# EAGLE design RPi Lego Server Daughter Board v1_0A (EAGLE 7.2.0)
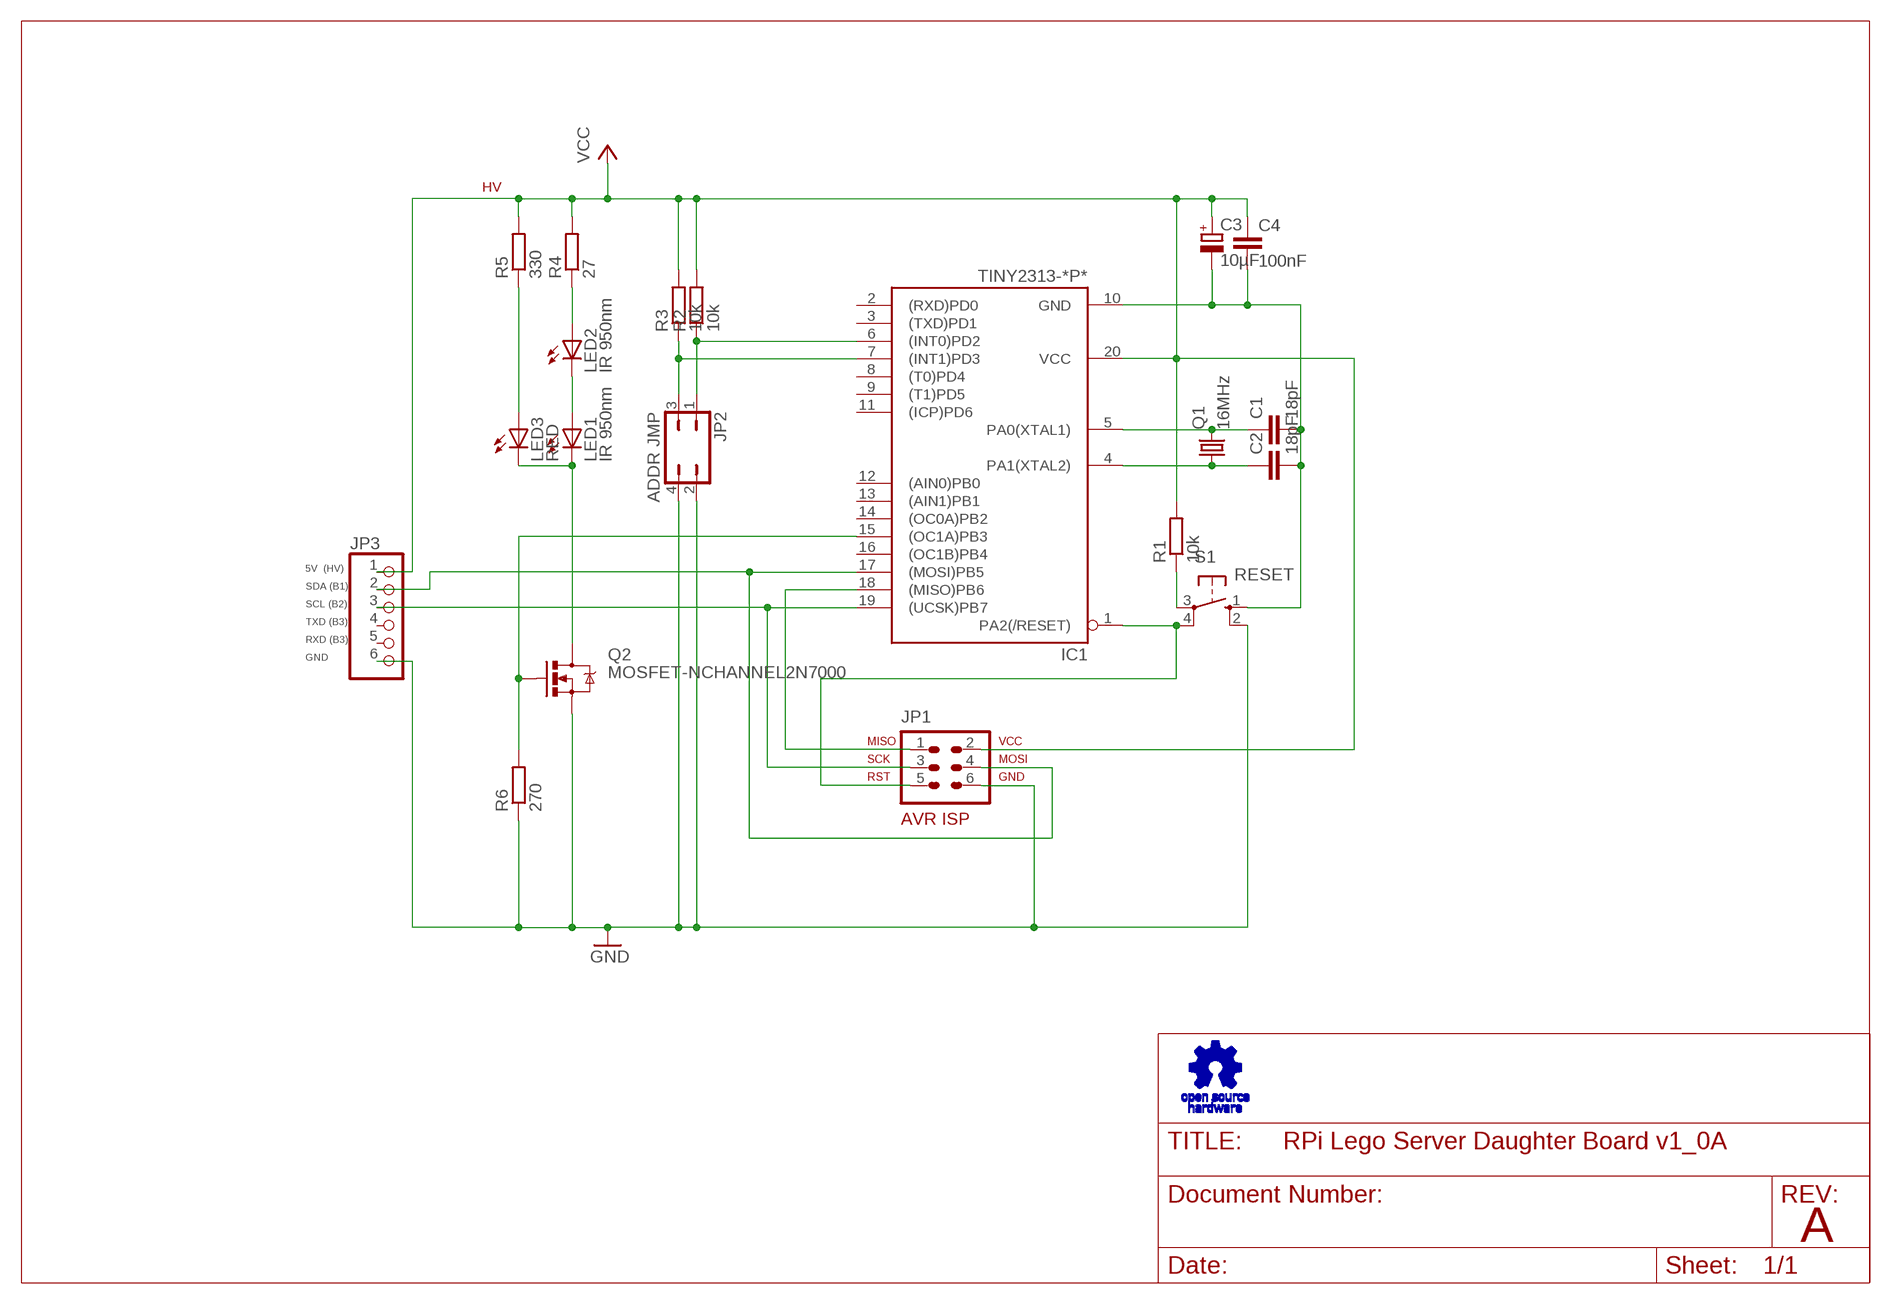
[diagram p0: schematic, sheet 1]

## Parts
C1  18pF  C-EU025-025X050  [C025-025X050]
C2  18pF  C-EU025-025X050  [C025-025X050]
C3  10µF  CPOL-EUE2.5-6  [E2,5-6]
C4  100nF  C-EU050-030X075  [C050-030X075]
IC1  TINY2313-*P*  [DIL20]
JP1  AVR-ISP-6VERT  [AVR-ISP-6]
JP2  ADDR JMP  JP2Q  [JP2Q]
JP3  PINHD-1X6  [1X06]
LED1  IR 950nm  LED5MM  [LED5MM]
LED2  IR 950nm  LED5MM  [LED5MM]
LED3  RED  LED3MM  [LED3MM]
Q1  16MHz  CRYSTALHC49S  [HC49/S]
Q2  MOSFET-NCHANNEL2N7000  [TO-92]
R1  10k  R-EU_0207_10  [0207/10]
R2  10k  R-EU_0207_10  [0207/10]
R3  10k  R-EU_0207_10  [0207/10]
R4  27  R-EU_0207_10  [0207/10]
R5  330  R-EU_0207_10  [0207/10]
R6  270  R-EU_0207_10  [0207/10]
S1  RESET  10-XX  [B3F-10XX]

## Nets
GND: C1.2 C2.2 C3.- C4.2 IC1.10(GND) JP1.6 JP2.2 JP2.4 JP3.6 Q2.1(S) R6.1 S1.1(S) S1.2(S1)
I2CADDRH: IC1.7((INT1)PD3) JP2.3 R3.1
I2CADDRL: IC1.6((INT0)PD2) JP2.1 R2.1
MISO: IC1.18((MISO)PB6) JP1.1
MOSI: IC1.17((MOSI)PB5) JP1.4 JP3.2
N$9: R1.1 S1.3(P)
N$12: LED2.A R4.1
N$13: LED3.A R5.1
N$14: LED1.A LED2.K(C)
N$15: LED1.K(C) LED3.K(C) Q2.3(D)
N$17: IC1.15((OC1A)PB3) Q2.2(G) R6.2
RST: IC1.1(PA2(/RESET)) JP1.5 S1.4(P1)
SCL: IC1.19((UCSK)PB7) JP1.3 JP3.3
VCC: C3.+ C4.1 IC1.20(VCC) JP1.2 JP3.1 R1.2 R2.2 R3.2 R4.2 R5.2
XTAL1: C2.1 IC1.4(PA1(XTAL2)) Q1.1
XTAL2: C1.1 IC1.5(PA0(XTAL1)) Q1.2
Unconnected: IC1.2((RXD)PD0) IC1.3((TXD)PD1) IC1.8((T0)PD4) IC1.9((T1)PD5) IC1.11((ICP)PD6) IC1.12((AIN0)PB0) IC1.13((AIN1)PB1) IC1.14((OC0A)PB2) IC1.16((OC1B)PB4) JP3.4 JP3.5

## Notes on the sheet
- HV
- 5V  (HV)
- SDA (B1)
- SCL (B2)
- TXD (B3)
- RXD (B3)
- GND
- /Users/xjmaas/Downloads/OSHW_Logo.bmp
- A

## Library data of the parts
C1 C2 C4 = rcl:C-EU: CAPACITOR, European symbol
C3 = rcl:CPOL-EU: POLARIZED CAPACITOR, European symbol
IC1 = avr-7:TINY2313*: Atmel Tiny2313 2K Flash, 128 bytes EEPROM, 128 bytes RAM
JP1 = avr-7:AVR-ISP-6: AVR ISP-6 Serial Programming Header
JP2 = jumper:JP2Q: JUMPER
JP3 = pinhead:PINHD-1X6: PIN HEADER
LED1-LED3 = led:LED: LED OSRAM: - CHIPLED LG R971, LG N971, LY N971, LG Q971, LY Q971, LO R971, LY R971 LH N974, LH R974 LS Q976, LO Q976, LY Q976 LO Q996 - Hyper CHIPLED LW Q18S LB Q993, LB Q99A, LB R99A - SideLED LS A670, LO A670, LY A670, LG A670, LP A670 LB A673, LV A673, LT A673, LW A673 LH A674 LY A675 LS A676, LA A676, LO A676, LY A676, LW A676 LS A679, LY A679, LG A679 - Hyper Micro SIDELED® LS Y876, LA Y876, LO Y876, LY Y876 LT Y87S - SmartLED LW L88C, LW L88S LB L89C, LB L89S, LG L890 LS L89K, LO L89K, LY L89K LS L896, LA L896, LO L896, LY L896 - TOPLED LS T670, LO T670, LY T670, LG T670, LP T670 LSG T670, LSP T670, LSY T670, LOP T670, LYG T670 LG T671, LOG T671, LSG T671 LB T673, LV T673, LT T673, LW T673 LH T674 LS T676, LA T676, LO T676, LY T676, LB T676, LH T676, LSB T676, LW T676 LB T67C, LV T67C, LT T67C, LS T67K, LO T67K, LY T67K, LW E67C LS E67B, LA E67B, LO E67B, LY E67B, LB E67C, LV E67C, LT E67C LW T67C LS T679, LY T679, LG T679 LS T770, LO T770, LY T770, LG T770, LP T770 LB T773, LV T773, LT T773, LW T773 LH T774 LS E675, LA E675, LY E675, LS T675 LS T776, LA T776, LO T776, LY T776, LB T776 LHGB T686 LT T68C, LB T68C - Hyper Mini TOPLED® LB M676 - Mini TOPLED Santana® LG M470 LS M47K, LO M47K, LY M47K Source: http://www.osram.convergy.de LUXEON: - LUMILED® LXK2-PW12-R00, LXK2-PW12-S00, LXK2-PW14-U00, LXK2-PW14-V00 LXK2-PM12-R00, LXK2-PM12-S00, LXK2-PM14-U00 LXK2-PE12-Q00, LXK2-PE12-R00, LXK2-PE12-S00, LXK2-PE14-T00, LXK2-PE14-U00 LXK2-PB12-K00, LXK2-PB12-L00, LXK2-PB12-M00, LXK2-PB14-N00, LXK2-PB14-P00, LXK2-PB14-Q00 LXK2-PR12-L00, LXK2-PR12-M00, LXK2-PR14-Q00, LXK2-PR14-R00 LXK2-PD12-Q00, LXK2-PD12-R00, LXK2-PD12-S00 LXK2-PH12-R00, LXK2-PH12-S00 LXK2-PL12-P00, LXK2-PL12-Q00, LXK2-PL12-R00 Source: www.luxeon.com KINGBRIGHT: KA-3528ASYC Source: www.kingbright.com
Q1 = crystal:CRYSTAL: CRYSTAL; OC_FARNELL: 1667008; OC_NEWARK: unknown
Q2 = SparkFun-DiscreteSemi:MOSFET-NCHANNEL: Common NMOSFET Parts MFG P/N Store ID Prod ID FDD8780 TRANS-09984 SI7820DN TRANS-11055 FDS6630A IC-08089 2N7002PW TRANS-11151 FQP30N06L COM-10213 TRANS-10060 BSS123LT1G TRANS-08345 BSS138 TRANS-00830 BS170 2N7000
R1-R6 = resistor:R-EU_: RESISTOR, European symbol; SPICEPREFIX: R
S1 = switch-omron:10-XX: OMRON SWITCH; MPN: B3F-1000; OC_FARNELL: 176432; OC_NEWARK: 36M3542

## Net classes
0 default: drill 0.61 mm

## Board
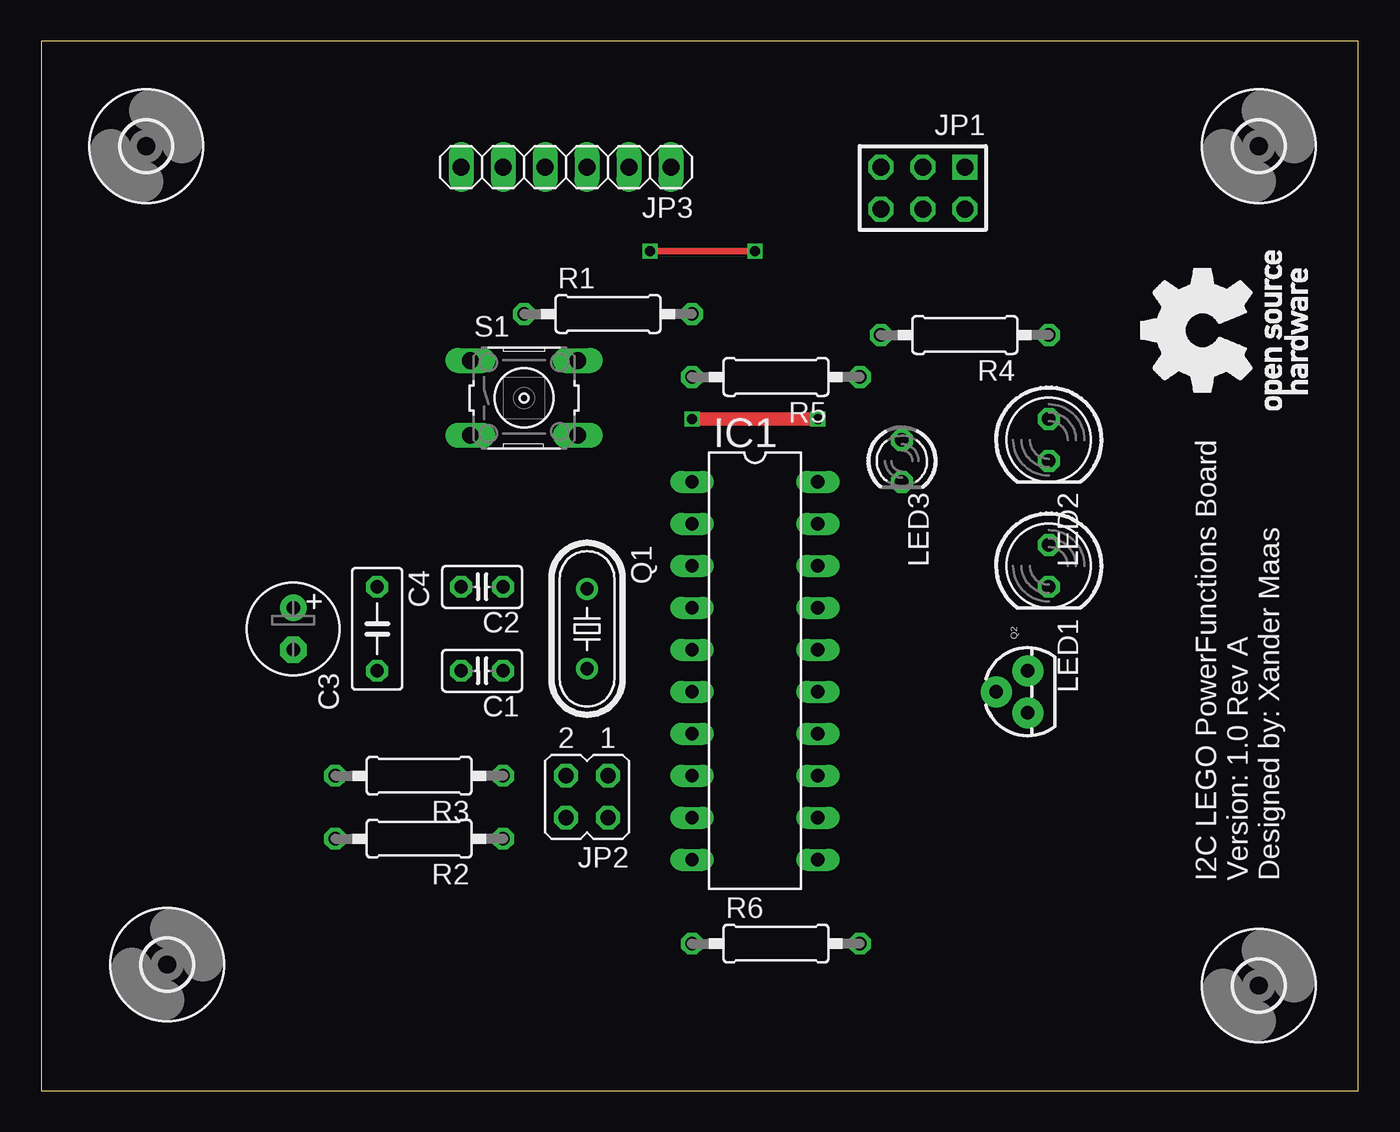
[diagram p1: board, top side]
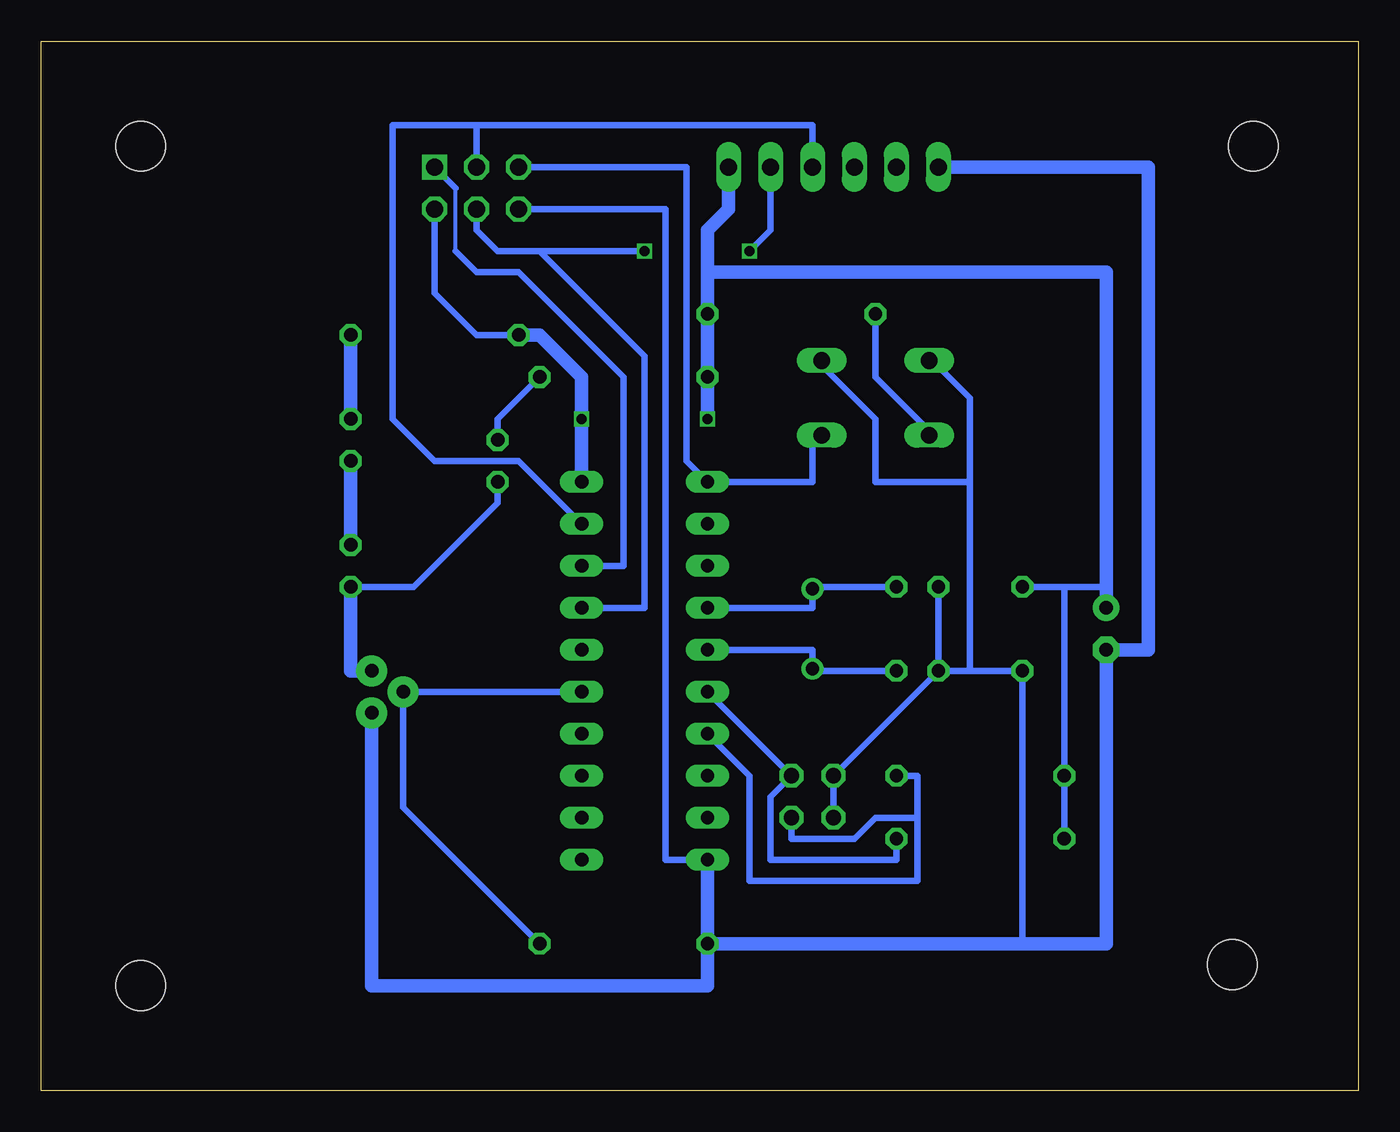
[diagram p2: board, bottom side, seen from below]

Size 79.68 x 63.49 mm. Coordinates in mm from the lower left corner, seen from the top.
Outline: 0,0 79.68,0 79.68,63.49 0,63.49 0,0
Copper layers (1*16): Top 0.035mm / dielectric 1.5mm / Bottom 0.035mm
Design rules "SeeedStudio_2layer_DRU_no_angle_20140221": minimum track width 6mil, minimum drill 12mil, track to track 6mil, track to pad 6mil, pad to pad 6mil, via to via 6mil, smd to smd 0mil, copper to edge 10mil, drill to drill 10mil, minimum pad ring 10mil, minimum via ring 6mil, stop-mask expansion 2mil, vias tented up to drill 100mil, thermal gap 10mil

### Footprints (pad centres in the part's own frame; a part is rotated, then mirrored left to right if it is on the bottom)
C025-025X050 = drill 0.813 octagon: 1 -1.27,0; 2 1.27,0
E2,5-6 = drill 0.813 pad 1.6: + -1.27,0 | drill 0.813 pad 1.6 octagon: - 1.27,0
C050-030X075 = drill 0.813 octagon: 1 -2.54,0; 2 2.54,0
DIL20 = drill 0.813 long: 1 -11.43,-3.81; 2 -8.89,-3.81; 3 -6.35,-3.81; 4 -3.81,-3.81; 5 -1.27,-3.81; 6 1.27,-3.81; 7 3.81,-3.81; 8 6.35,-3.81; 9 8.89,-3.81; 10 11.43,-3.81; 11 11.43,3.81; 12 8.89,3.81; 13 6.35,3.81; 14 3.81,3.81; 15 1.27,3.81; 16 -1.27,3.81; 17 -3.81,3.81; 18 -6.35,3.81; 19 -8.89,3.81; 20 -11.43,3.81
AVR-ISP-6 = drill 1.016 square: 1 -2.54,-1.27 | drill 1.016 octagon: 2 -2.54,1.27; 3 0,-1.27; 4 0,1.27; 5 2.54,-1.27; 6 2.54,1.27
JP2Q = drill 0.914 octagon: 1 -1.27,-1.27; 2 1.27,-1.27; 3 -1.27,1.27; 4 1.27,1.27
1X06 = drill 1.016 long: 1 -6.35,0; 2 -3.81,0; 3 -1.27,0; 4 1.27,0; 5 3.81,0; 6 6.35,0
LED5MM = drill 0.813 octagon: A -1.27,0; K 1.27,0
LED3MM = drill 0.813 octagon: A -1.27,0; K 1.27,0
HC49/S = drill 0.813: 1 -2.413,0; 2 2.413,0
TO-92 = drill 0.813 pad 1.88: 1 -1.27,0; 2 0,1.905; 3 1.27,0
0207/10 = drill 0.813 octagon: 1 -5.08,0; 2 5.08,0
B3F-10XX = drill 1.016 long: 1 -3.251,2.261; 2 3.251,2.261; 3 -3.251,-2.261; 4 3.251,-2.261
3,0 = hole 3: 0,0

### Placement (x,y rotation side)
C1  26.67,25.4 180 top
C2  26.67,30.48 180 top
C3  15.24,27.94 270 top
C4  20.32,27.94 270 top
IC1  43.18,25.4 270 top
JP1  53.34,54.61 180 top
JP2  33.02,17.78 180 top
JP3  31.75,55.88 180 top
LED1  60.96,31.75 270 top
LED2  60.96,39.37 270 top
LED3  52.07,38.1 270 top
Q1  33.02,27.94 270 top
Q2  59.69,24.13 90 top
R1  34.29,46.99 0 top
R2  22.86,15.24 180 top
R3  22.86,19.05 180 top
R4  55.88,45.72 180 top
R5  44.45,43.18 180 top
R6  44.45,8.89 0 top
S1  29.21,41.91 0 top
U$2  [3,0]  73.66,6.35 0 top
U$3  [3,0]  73.66,57.15 0 top
U$4  [3,0]  6.35,57.15 0 top
U$5  [3,0]  7.62,7.62 0 top

### Tracks (layer width: path | path; a pad name or v marks a point on that pad's centre or on a via)
GND
  Bottom 0.254: 39.37,12.7 R6.1
  Bottom 0.406: JP2.4 JP2.2 C1.2 | C1.2 23.5,25.4 | C1.2 C2.2 | 23.5,25.4 23.5,36.83 | 23.5,36.83 23.5,41.91 25.4,43.81 S1.1 | S1.2 32.38,43.81 29.21,40.64 29.21,36.83 23.5,36.83 | JP1.6 41.91,53.34 41.91,13.97 IC1.10 39.37,12.7 | 20.32,8.89 C4.2 23.5,25.4
  Bottom 0.813: IC1.10 R6.1 | R6.1 20.32,8.89 15.24,8.89 C3.- 12.7,26.67 12.7,55.88 JP3.6 | Q2.1 59.69,6.35 39.37,6.35 R6.1
I2CADDRH
  Bottom 0.406: 26.67,16.51 26.67,19.05 R3.1 | 26.67,16.51 26.67,12.7 36.83,12.7 36.83,19.05 IC1.7 | JP2.3 34.29,15.24 30.48,15.24 29.21,16.51 26.67,16.51
I2CADDRL
  Bottom 0.406: IC1.6 JP2.1 35.56,17.78 35.56,13.97 27.94,13.97 R2.1
MISO
  Bottom 0.254: 54.61,50.8 54.61,54.61
  Bottom 0.406: IC1.18 44.45,31.75 44.45,43.18 50.8,49.53 53.34,49.53 54.61,50.8 | 54.61,54.61 JP1.1
MOSI  (via drill 0.61)
  Top 0.406: v36.83,50.8 v43.18,50.8
  Bottom 0.406: IC1.17 43.18,29.21 43.18,44.45 49.53,50.8 | 49.53,50.8 52.07,50.8 53.34,52.07 JP1.4 | JP3.2 35.56,52.07 v36.83,50.8 | v43.18,50.8 49.53,50.8
N$9
  Bottom 0.406: R1.1 29.21,43.18 26.04,40 S1.3
N$12
  Bottom 0.813: R4.1 LED2.A
N$13
  Bottom 0.406: R5.1 52.07,40.64 LED3.A
N$14
  Bottom 0.813: LED2.K LED1.A
N$15
  Bottom 0.406: LED1.K 57.15,30.48 52.07,35.56 LED3.K
  Bottom 0.813: Q2.3 60.96,25.4 LED1.K
N$17
  Bottom 0.406: R6.2 57.78,17.14 Q2.2 IC1.15
RST
  Bottom 0.254: 33.02,39.37 S1.4
  Bottom 0.406: 33.02,39.37 33.02,36.83 IC1.1 40.64,38.1 40.64,55.88 JP1.5
SCL
  Bottom 0.406: IC1.19 50.8,38.1 55.88,38.1 58.42,40.64 58.42,58.42 53.34,58.42 | JP3.3 33.02,58.42 53.34,58.42 | JP1.3 53.34,58.42
VCC  (via drill 0.61 pad 0.81)
  Top 0.813: v39.37,40.64 v46.99,40.64
  Bottom 0.406: R2.2 R3.2 17.78,30.48 | 15.24,30.48 17.78,30.48 | 17.78,30.48 C4.1 | R1.2 R5.2 | JP1.2 55.88,48.26 53.34,45.72 R4.2
  Bottom 0.813: C3.+ 15.24,30.48 15.24,36.83 15.24,38.1 15.24,49.53 39.37,49.53 | IC1.20 v46.99,40.64 46.99,43.18 49.53,45.72 R4.2 | 39.37,49.53 R5.2 v39.37,40.64 | 39.37,49.53 39.37,52.07 38.1,53.34 JP3.1
XTAL1
  Bottom 0.254: 33.02,30.48 Q1.1
  Bottom 0.406: 33.02,30.48 C2.1 | IC1.4 33.02,29.21 Q1.1
XTAL2
  Bottom 0.254: 33.02,25.4 Q1.2
  Bottom 0.406: 33.02,25.4 C1.1 | IC1.5 33.02,26.67 Q1.2

### Text on the board
tPlace: /Users/xjmaas/Downloads/OSHW_Logo.bmp | I2C LEGO PowerFunctions Board / Version: 1.0 Rev A / Designed by: Xander Maas